# Altium schematic sheet AWR2243.SchDoc: =ProjectTitle
size A3; PageSetup: Record=PageOptions|CenterHorizontal=True|CenterVertical=True|PrintScale=1.00|XCorrection=1.00|YCorrection=1.00|PrintKind=0|BorderSize=5000000|LeftOffset=0|BottomOffset=0|Orientation=2|PaperLength=1000|PaperWidth=1000|Scale=100|PaperSource=15|PrintQuality=600|MediaType=1|DitherType=10|PaperKind=Letter|PrintScaleMode=1; Author: Jaime I. Chait; Organization: NWES LLC; Address1: 111 SW 5th Ave, STE 3150; Address2: Portland, OR 97204; SheetNumber: 4; SheetTotal: 19
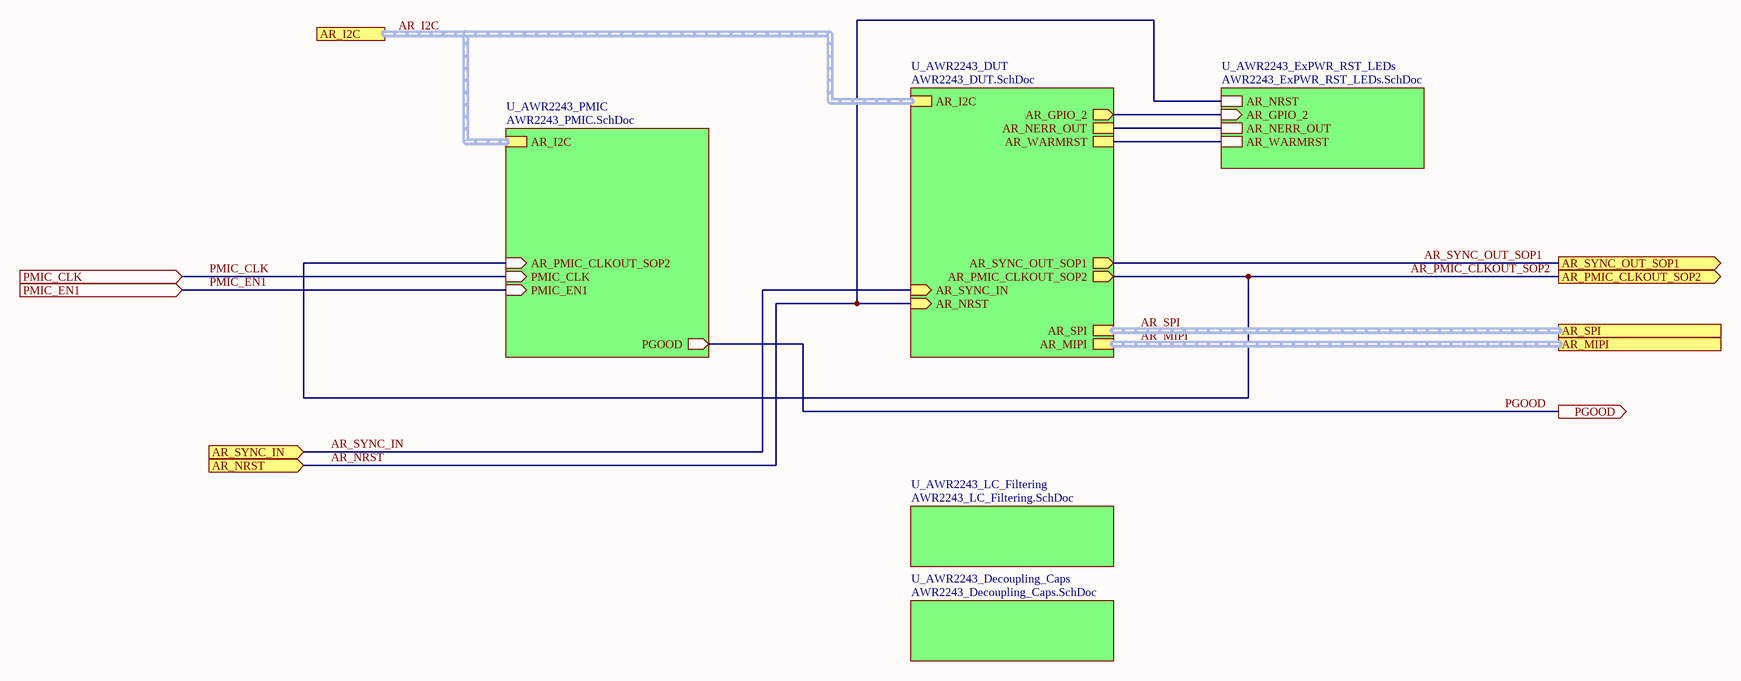
[diagram p0: AWR2243.SchDoc]

## Sub-sheets
U_AWR2243_Decoupling_Caps = AWR2243_Decoupling_Caps.SchDoc: no entries
U_AWR2243_DUT = AWR2243_DUT.SchDoc: AR_SYNC_IN (in), AR_MIPI (harness AR_MIPI), AR_SPI (harness SPI), AR_GPIO_2 (out), AR_PMIC_CLKOUT_SOP2 (out), AR_NRST (in), AR_SYNC_OUT_SOP1 (out), AR_NERR_OUT, AR_WARMRST, AR_I2C (harness I2C)
U_AWR2243_ExPWR_RST_LEDs = AWR2243_ExPWR_RST_LEDs.SchDoc: AR_NRST, AR_GPIO_2 (in), AR_NERR_OUT, AR_WARMRST
U_AWR2243_LC_Filtering = AWR2243_LC_Filtering.SchDoc: no entries
U_AWR2243_PMIC = AWR2243_PMIC.SchDoc: PMIC_CLK (in), PMIC_EN1 (in), PGOOD (out), AR_PMIC_CLKOUT_SOP2 (in), AR_I2C (harness I2C)

## Ports
AR_I2C (harness I2C), AR_MIPI (harness AR_MIPI), AR_NRST (in), AR_PMIC_CLKOUT_SOP2 (out), AR_SPI (harness SPI), AR_SYNC_IN (in), AR_SYNC_OUT_SOP1 (out), PGOOD (out), PMIC_CLK (in), PMIC_EN1 (in)

## Nets
AR_NRST: port AR_NRST, sheet U_AWR2243_DUT/AR_NRST, sheet U_AWR2243_ExPWR_RST_LEDs/AR_NRST
AR_PMIC_CLKOUT_SOP2: port AR_PMIC_CLKOUT_SOP2, sheet U_AWR2243_DUT/AR_PMIC_CLKOUT_SOP2, sheet U_AWR2243_PMIC/AR_PMIC_CLKOUT_SOP2
AR_SYNC_IN: port AR_SYNC_IN, sheet U_AWR2243_DUT/AR_SYNC_IN
AR_SYNC_OUT_SOP1: port AR_SYNC_OUT_SOP1, sheet U_AWR2243_DUT/AR_SYNC_OUT_SOP1
PGOOD: port PGOOD, sheet U_AWR2243_PMIC/PGOOD
PMIC_CLK: port PMIC_CLK, sheet U_AWR2243_PMIC/PMIC_CLK
PMIC_EN1: port PMIC_EN1, sheet U_AWR2243_PMIC/PMIC_EN1
(unnamed): sheet U_AWR2243_DUT/AR_GPIO_2, sheet U_AWR2243_ExPWR_RST_LEDs/AR_GPIO_2
(unnamed): sheet U_AWR2243_DUT/AR_NERR_OUT, sheet U_AWR2243_ExPWR_RST_LEDs/AR_NERR_OUT
(unnamed): sheet U_AWR2243_DUT/AR_WARMRST, sheet U_AWR2243_ExPWR_RST_LEDs/AR_WARMRST

## Buses and harness runs
harness AR_I2C = port AR_I2C = sheet U_AWR2243_DUT/AR_I2C = sheet U_AWR2243_PMIC/AR_I2C
harness AR_MIPI = port AR_MIPI = sheet U_AWR2243_DUT/AR_MIPI
harness AR_SPI = port AR_SPI = sheet U_AWR2243_DUT/AR_SPI

## Notes on the sheet
- Title
- Size:
- Date:
- A4
- Number:
- Time:
- Revision:
- Sheet
- of
- File: